# Altium schematic sheet 02_IO_Interface.SchDoc: Mainboard IO
size A3; SheetNumber: 6; SheetTotal: 13
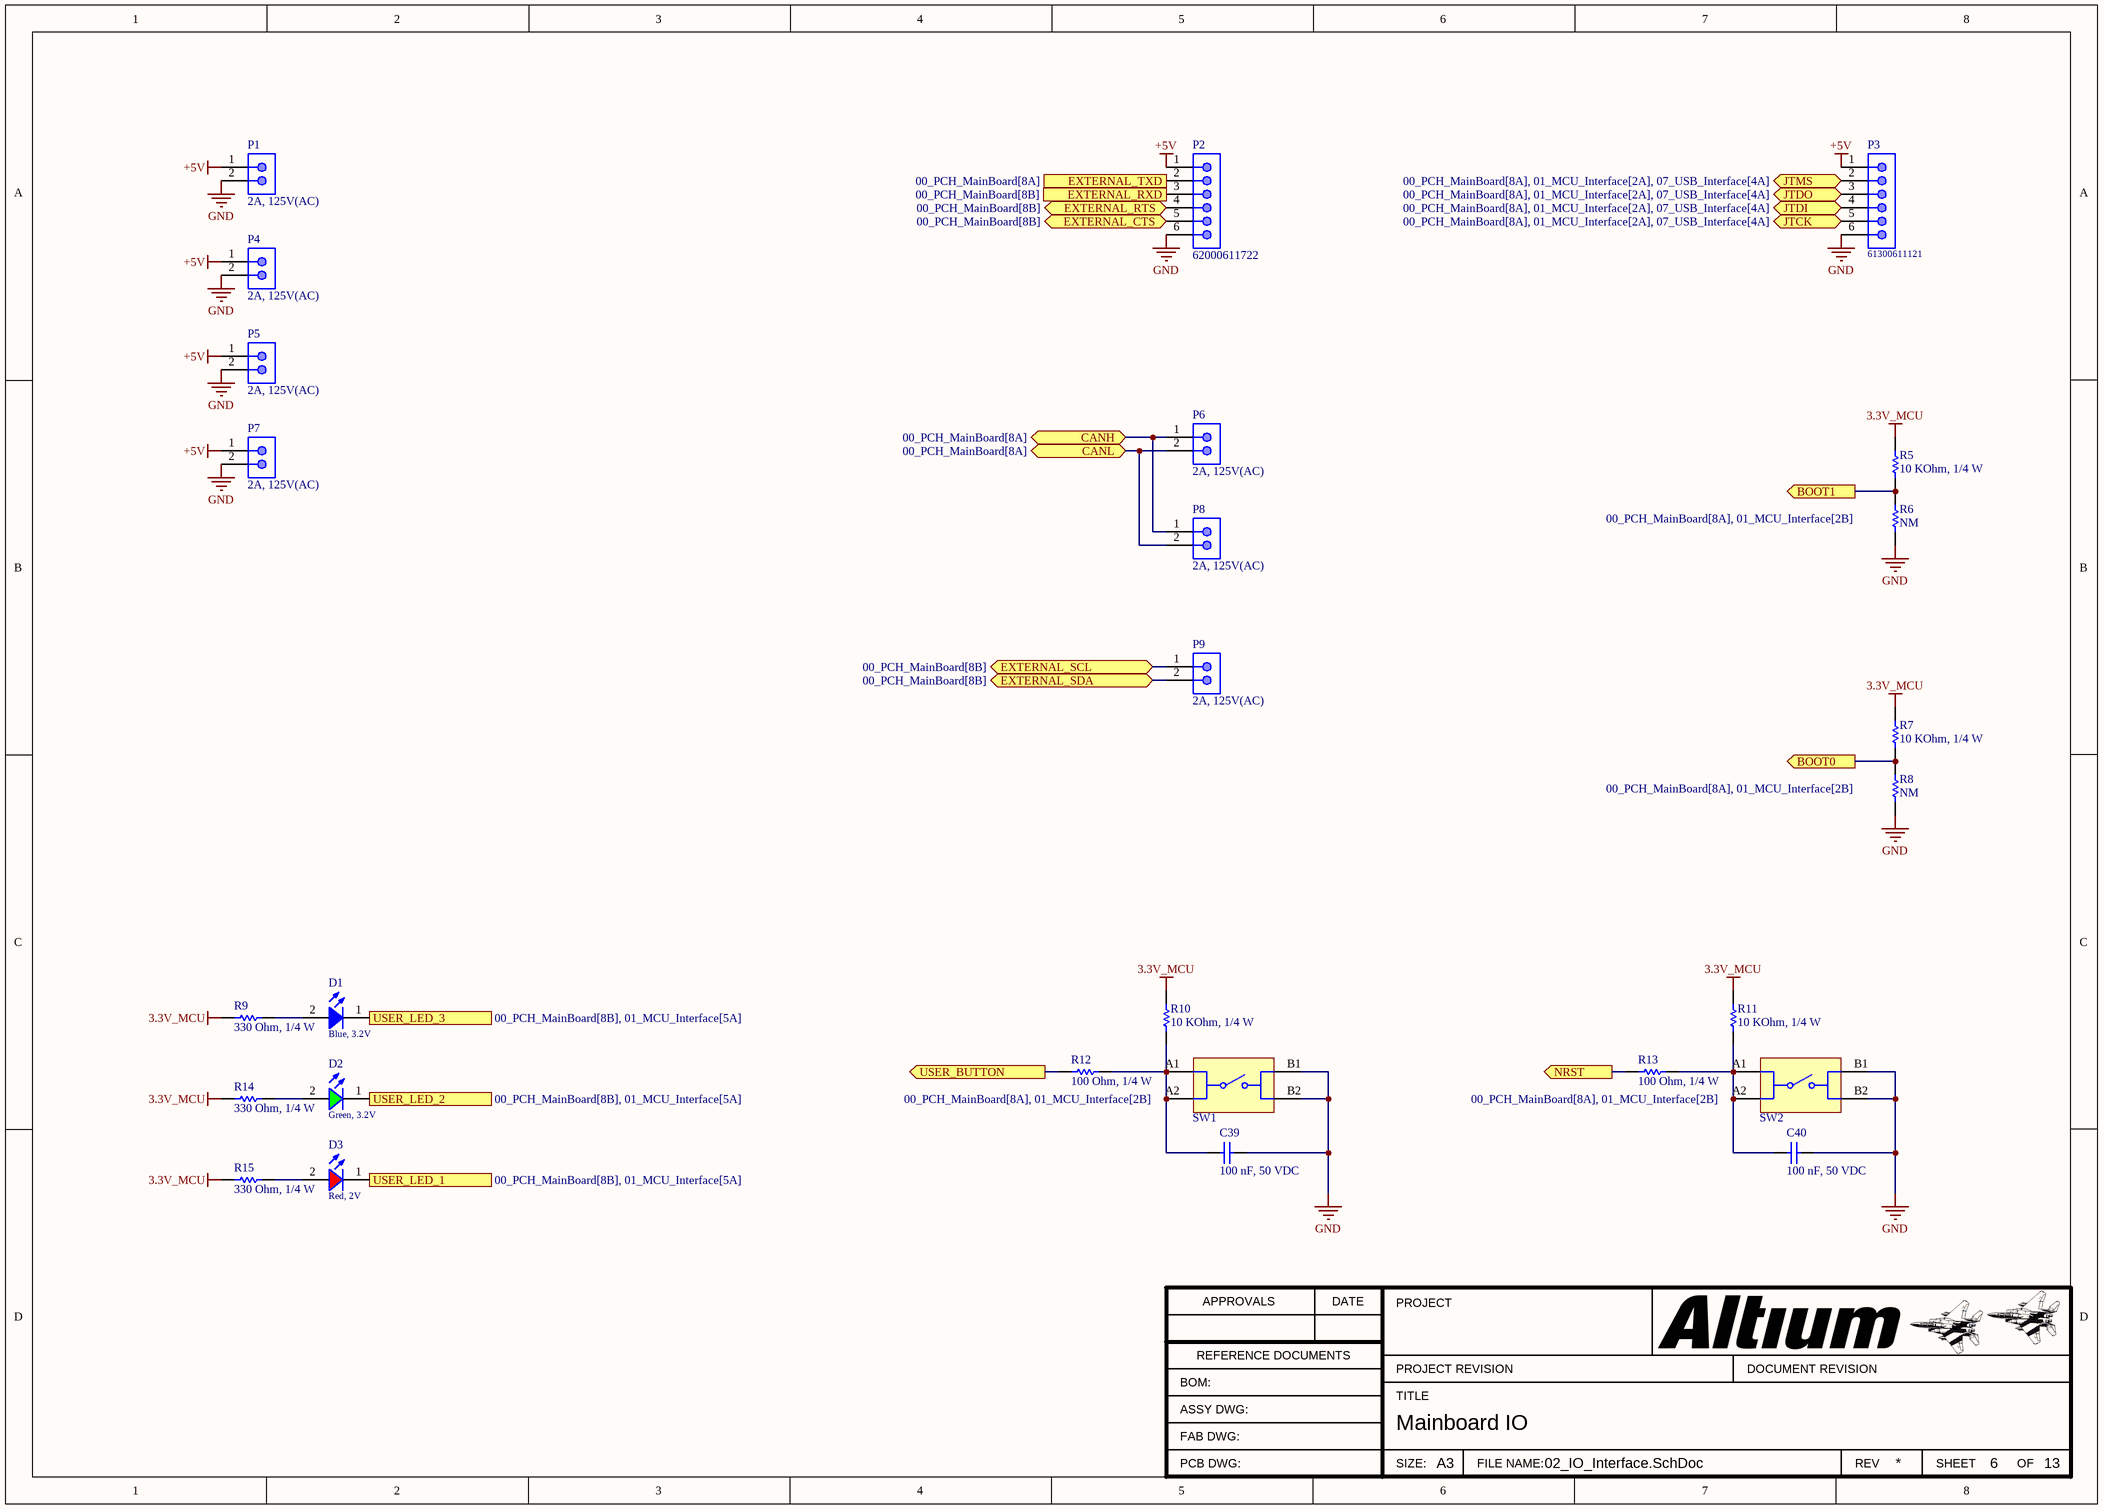
[diagram p0: 02_IO_Interface.SchDoc]

## Parts
C39  100 nF, 50 VDC  [CAP_0603]
C40  100 nF, 50 VDC  [CAP_0603]
D1  Blue, 3.2V  [WL-SMCW_0603_H=0.7mm]
D2  Green, 3.2V  [WL-SMCW_0603_H=0.7mm]
D3  Red, 2V  [WL-SMCW_0603_H=0.7mm]
P1  2A, 125V(AC)  [620102131822]
P2  62000611722  [62000611722]
P3  61300611121  [61300611121]
P4  2A, 125V(AC)  [620102131822]
P5  2A, 125V(AC)  [620102131822]
P6  2A, 125V(AC)  [620102131822]
P7  2A, 125V(AC)  [620102131822]
P8  2A, 125V(AC)  [620102131822]
P9  2A, 125V(AC)  [620102131822]
R5  10 KOhm, 1/4 W  [resistor_0603]
R6  NM  [resistor_0603]
R7  10 KOhm, 1/4 W  [resistor_0603]
R8  NM  [resistor_0603]
R9  330 Ohm, 1/4 W  [resistor_0603]
R10  10 KOhm, 1/4 W  [resistor_0603]
R11  10 KOhm, 1/4 W  [resistor_0603]
R12  100 Ohm, 1/4 W  [resistor_0603]
R13  100 Ohm, 1/4 W  [resistor_0603]
R14  330 Ohm, 1/4 W  [resistor_0603]
R15  330 Ohm, 1/4 W  [resistor_0603]
SW1  430451035836  [WS-TASV_L6W6H3.5_4304x10358x6]  (value not drawn)
SW2  430451035836  [WS-TASV_L6W6H3.5_4304x10358x6]  (value not drawn)

## Ports
BOOT0 (out, see 00_PCH_MainBoard[8A], 01_MCU_Interface[2B]), BOOT1 (out, see 00_PCH_MainBoard[8A], 01_MCU_Interface[2B]), CANH (bidir, see 00_PCH_MainBoard[8A]), CANL (bidir, see 00_PCH_MainBoard[8A]), EXTERNAL_CTS (bidir, see 00_PCH_MainBoard[8B]), EXTERNAL_RTS (bidir, see 00_PCH_MainBoard[8B]), EXTERNAL_RXD (out, see 00_PCH_MainBoard[8B]), EXTERNAL_SCL (bidir, see 00_PCH_MainBoard[8B]), EXTERNAL_SDA (bidir, see 00_PCH_MainBoard[8B]), EXTERNAL_TXD (in, see 00_PCH_MainBoard[8A]), JTCK (bidir, see 00_PCH_MainBoard[8A], 01_MCU_Interface[2A], 07_USB_Interface[4A]), JTDI (bidir, see 00_PCH_MainBoard[8A], 01_MCU_Interface[2A], 07_USB_Interface[4A]), JTDO (bidir, see 00_PCH_MainBoard[8A], 01_MCU_Interface[2A], 07_USB_Interface[4A]), JTMS (bidir, see 00_PCH_MainBoard[8A], 01_MCU_Interface[2A], 07_USB_Interface[4A]), NRST (out, see 00_PCH_MainBoard[8A], 01_MCU_Interface[2B]), USER_BUTTON (out, see 00_PCH_MainBoard[8A], 01_MCU_Interface[2B]), USER_LED_1 (out, see 00_PCH_MainBoard[8B], 01_MCU_Interface[5A]), USER_LED_2 (out, see 00_PCH_MainBoard[8B], 01_MCU_Interface[5A]), USER_LED_3 (out, see 00_PCH_MainBoard[8B], 01_MCU_Interface[5A])

## Nets
3.3V_MCU: R5.2 R7.2 R9.2 R10.2 R11.2 R14.2 R15.2
+5V: P1.1 P2.1 P3.1 P4.1 P5.1 P7.1
GND: C39.2 C40.2 P1.2 P2.6 P3.6 P4.2 P5.2 P7.2 R6.1 R8.1 SW1.B1 SW1.B2 SW2.B1 SW2.B2
BOOT0: R7.1 R8.2 ; port BOOT0
BOOT1: R5.1 R6.2 ; port BOOT1
CANH: P6.1 P8.1 ; port CANH
CANL: P6.2 P8.2 ; port CANL
EXTERNAL_CTS: P2.5 ; port EXTERNAL_CTS
EXTERNAL_RTS: P2.4 ; port EXTERNAL_RTS
EXTERNAL_RXD: P2.3 ; port EXTERNAL_RXD
EXTERNAL_SCL: P9.1 ; port EXTERNAL_SCL
EXTERNAL_SDA: P9.2 ; port EXTERNAL_SDA
EXTERNAL_TXD: P2.2 ; port EXTERNAL_TXD
JTCK: P3.5 ; port JTCK
JTDI: P3.4 ; port JTDI
JTDO: P3.3 ; port JTDO
JTMS: P3.2 ; port JTMS
NRST: R13.1 ; port NRST
USER_BUTTON: R12.1 ; port USER_BUTTON
USER_LED_1: D3.1(K) ; port USER_LED_1
USER_LED_2: D2.1(K) ; port USER_LED_2
USER_LED_3: D1.1(K) ; port USER_LED_3
NetC39_1: C39.1 R10.1 R12.2 SW1.A1 SW1.A2
NetC40_1: C40.1 R11.1 R13.2 SW2.A1 SW2.A2
NetD1_2: D1.2(A) R9.1
NetD2_2: D2.2(A) R14.1
NetD3_2: D3.2(A) R15.1

## Notes on the sheet
- APPROVALS
- DATE
- PROJECT
- BOM:
- REFERENCE DOCUMENTS
- TITLE
- PROJECT REVISION
- DOCUMENT REVISION
- ASSY DWG:
- FAB DWG:
- PCB DWG:
- SIZE:
- A3
- FILE NAME:
- REV
- SHEET
- OF

## Library data of the parts
C39 C40 = 0106031041050: CAP, size 0603, 100 nF, 50 VDC; Manufacture Name: TDK; Manufacture SN: CGA3E3X8R1H104K080AE; Capacitance: 100 nF; Tolerance: +/-10%; Voltage Rating DC: 50 VDC; ComponentLink2Description: Datasheet; ComponentLink2URL: https://product.tdk.com/system/files/dam/doc/product/capacitor/ceramic/mlcc/catalog/mlcc_automotive_soft_en.pdf?ref_disty=mouser; Operating Temperature: -55 to +125degC; Packaging: Tape and Reel; Mounting Technology: SMT; Size: 0603; Supplier 1 Name: Mouser; Supplier 1 SN: 810-CGA3E3X8R1H104KA; Supplier 1 URL: https://www.mouser.com/ProductDetail/TDK/CGA3E3X8R1H104K080AE?qs=nQSIdc08i%252Bd8g3IRRgU2bw%3D%3D&utm_source=mouser-refine-download&utm_medium=file&utm_campaign=CGA3E3X8R1H104K080AE&utm_content=TDK; Supplier 2 Name: Digi-Key; Supplier 2 SN: 445-173697-2-ND; Supplier 2 URL: https://www.digikey.com/en/products/detail/tdk-corporation/cga3e3x8r1h104k080ae/5809262; Supplier 3 Name: thegioiic; Supplier 3 SN: N/A; Supplier 3 URL: N/A; Value: 100 nF, 50 VDC
D1 = 160603BlueBlur: WL-SMCW SMT Mono-color Chip LED Blur, size 0603, Blue, 3.2V, 140deg; Color: Blue; Size: 0603; Type: Blur; ComponentLink1Description: Datasheet link; ComponentLink1URL: N/A; ComponentLink2Description: Supplier 1 URL; ComponentLink2URL: https://www.mouser.vn/ProductDetail/ams-OSRAM/LB-Q39E-L2OO-35-1?qs=74fRo9GAWsz%2FeNvglIOl1w%3D%3D; ComponentLink3Description: Supplier 2 URL; ComponentLink3URL: https://www.digikey.com/en/products/detail/ams-osram-usa-inc/LB-Q39E-N1OO-35-1/2176321; ComponentLink4Description: Supplier 3 URL; ComponentLink4URL: N/A; Supplier 1 Name: Mouser; Supplier 1 SN: 720-LBQ39EL2N2351; Supplier 1 URL: https://www.mouser.vn/ProductDetail/ams-OSRAM/LB-Q39E-L2OO-35-1?qs=74fRo9GAWsz%2FeNvglIOl1w%3D%3D; Supplier 2 Name: Digi-Key; Supplier 2 SN: 475-LBQ39E-N1OO-35-1TR-ND; Supplier 2 URL: https://www.digikey.com/en/products/detail/ams-osram-usa-inc/LB-Q39E-N1OO-35-1/2176321; Supplier 3 Name: ICDayRoi; Supplier 3 SN: N/A; Supplier 3 URL: N/A; Value: Blue, 3.2V
D2 = 160603GreenBlur: WL-SMCW SMT Mono-color Chip LED Blur, size 0603, Green, 3.2V, 140deg; Color: Green; Size: 0603; Type: Blur; ComponentLink1Description: Datasheet link; ComponentLink1URL: N/A; ComponentLink2Description: Supplier 1 URL; ComponentLink2URL: https://www.mouser.vn/ProductDetail/ROHM-Semiconductor/SMLD12EN1WT86?qs=qSfuJ%252Bfl%2Fd4fR%252B9yZydIwg%3D%3D; ComponentLink3Description: Supplier 2 URL; ComponentLink3URL: https://www.digikey.com/en/products/detail/rohm-semiconductor/SML-D12M8WT86/1641797; ComponentLink4Description: Supplier 3 URL; ComponentLink4URL: N/A; Supplier 1 Name: Mouser; Supplier 1 SN: 755-SMLD12EN1WT86; Supplier 1 URL: https://www.mouser.vn/ProductDetail/ROHM-Semiconductor/SMLD12EN1WT86?qs=qSfuJ%252Bfl%2Fd4fR%252B9yZydIwg%3D%3D; Supplier 2 Name: Digi-Key; Supplier 2 SN: 511-1578-2-ND; Supplier 2 URL: https://www.digikey.com/en/products/detail/rohm-semiconductor/SML-D12M8WT86/1641797; Supplier 3 Name: ICDayRoi; Supplier 3 SN: N/A; Supplier 3 URL: N/A; Value: Green, 3.2V
D3 = 160603RedBlur: WL-SMCW SMT Mono-color Chip LED Blur, size 0603, Red, 2V, 140deg; Color: Red; Size: 0603; Type: Blur; ComponentLink1Description: Datasheet link; ComponentLink1URL: N/A; ComponentLink2Description: Supplier 1 URL; ComponentLink2URL: https://www.mouser.vn/ProductDetail/ROHM-Semiconductor/CSL1901VW1?qs=vvQtp7zwQdNmrXZcE27xEA%3D%3D; ComponentLink3Description: Supplier 2 URL; ComponentLink3URL: https://www.digikey.com/en/products/detail/rohm-semiconductor/SML-D12U8WT86/1641799; ComponentLink4Description: Supplier 3 URL; ComponentLink4URL: N/A; Supplier 1 Name: Mouser; Supplier 1 SN: 755-CSL1901VW1; Supplier 1 URL: https://www.mouser.vn/ProductDetail/ROHM-Semiconductor/CSL1901VW1?qs=vvQtp7zwQdNmrXZcE27xEA%3D%3D; Supplier 2 Name: Digi-Key; Supplier 2 SN: 511-1580-2-ND; Supplier 2 URL: https://www.digikey.com/en/products/detail/rohm-semiconductor/SML-D12U8WT86/1641799; Supplier 3 Name: ICDayRoi; Supplier 3 SN: N/A; Supplier 3 URL: N/A; Value: Red, 2V
P1 P4-P9 = 620102131822: WR-WTB SMT Male Horizontal Shrouded Header, pitch 2mm, 2p; Pin Number: 2; Contact Resistance: 20mOhm; Withstanding Voltage: 800VAC; Working Voltage: 100VAC; ComponentLink1Description: Datasheet link; ComponentLink1URL: https://www.we-online.com/catalog/datasheet/620102131822.pdf; ComponentLink2Description: Supplier 1 URL; ComponentLink2URL: https://www.mouser.vn/ProductDetail/Wurth-Elektronik/620102131822?qs=ZtY9WdtwX54K2dkLvxjzuQ%3D%3D; Pitch: 2mm; Published Date: January 2020; Publisher: Wurth Elektronik; Mounting Technology: SMT; Packaging: Tape and Reel; Operating Temperature: -25 to +85degC; Part Number: 620102131822; Gender: Male; Type: Horizontal; Rated Current: 2A; ComponentLink3Description: Supplier 2 URL; ComponentLink3URL: N/A; ComponentLink4Description: Supplier 3 URL; ComponentLink4URL: https://www.thegioiic.com/dau-ph-2-0mm-2-chan-dan-smd-nam-ngang; Supplier 1 Name: Mouser; Supplier 1 SN: 710-620102131822; Supplier 1 URL: https://www.mouser.vn/ProductDetail/Wurth-Elektronik/620102131822?qs=ZtY9WdtwX54K2dkLvxjzuQ%3D%3D; Supplier 2 Name: Digi-Key; Supplier 2 SN: N/A; Supplier 2 URL: N/A; Supplier 3 Name: thegioiic; Supplier 3 SN: N/A; Supplier 3 URL: https://www.thegioiic.com/dau-ph-2-0mm-2-chan-dan-smd-nam-ngang; Value: 2A, 125V(AC)
P2 = 62000611722: WR-WTB THT Male Horizontal Shrouded Header, pitch 2mm, 6p; Pin Number: 6; Contact Resistance: 20mOhm; Rated Current: 2A; Withstanding Voltage: 800VAC; Working Voltage: 125VAC; Value: 2A, 125V(AC); ComponentLink1Description: Datasheet link; ComponentLink1URL: https://www.we-online.com/catalog/datasheet/62000611722.pdf; ComponentLink2Description: Supplier 1 URL; ComponentLink2URL: N/A; Pitch: 2mm; Published Date: January 2020; Publisher: Wurth Elektronik; Mounting Technology: THT; Packaging: Bag; Operating Temperature: -25 to +85degC; Part Number: 62000611722; Gender: Male; Type: Horizontal; ComponentLink3Description: Supplier 2 URL; ComponentLink3URL: N/A; Supplier 1 Name: Mouser; Supplier 1 SN: N/A; Supplier 1 URL: N/A; Supplier 2 Name: Digi-Key; Supplier 2 SN: N/A; Supplier 2 URL: N/A; Supplier 3 Name: thegioiic; Supplier 3 SN: N/A; Supplier 3 URL: https://www.thegioiic.com/dau-ph-2-0mm-6-chan-cong-xuyen-lo; ComponentLink4Description: Supplier 3 URL; ComponentLink4URL: https://www.thegioiic.com/dau-ph-2-0mm-6-chan-cong-xuyen-lo
P3 = 61300611121: WR-PHD Pin Header, THT, pitch 2.54mm, Single Row, Vertical, 6p; Manufacturer: Wurth Elektronik; Pin Number: 6; Rated Current: 3A; Working Voltage: 250VAC; Withstanding Voltage: 500VAC; Contact Resistance: 20mOhm; Supply Name 1: Mouser; ComponentLink1Description: Manufacturer; ComponentLink1URL: http://www.we-online.de; ComponentLink2Description: Datasheet; ComponentLink2URL: https://www.we-online.com/catalog/datasheet/61300611121.pdf; Manufacturer Part Number: 61300611121; Published Date: May 2020; Pitch: 2.54mm; Operating Temperature: -40 to +105degC; Mounting Technology: THT; Packaging: Bag; Gender: Pin Header; Row Number: Single; Orientation: Vertical; ComponentLink3Description: Global Supply; ComponentLink3URL: https://www.we-online.com/en/components/products/PHD_2_54_THT_PIN_HEADER_6130XX11121?sq=61300611121#61300611121; ComponentLink4Description: Global Supply; ComponentLink4URL: https://www.mouser.vn/ProductDetail/Wurth-Elektronik/61300611121?qs=t4813l51qx%2FRpdf0Kp1HlQ%3D%3D; Supplier 1 Name: Mouser; Supplier 1 SN: 710-61300611121; Supplier 1 URL: https://www.mouser.vn/ProductDetail/Wurth-Elektronik/61300611121?qs=t4813l51qx%2FRpdf0Kp1HlQ%3D%3D; Supplier 2 Name: Digi-Key; Supplier 2 SN: N/A; Supplier 2 URL: N/A; Supplier 3 Name: thegioiic; Supplier 3 SN: N/A; Supplier 3 URL: N/A
R5 R7 R10 R11 = 0006031031: RES, size 0603, 10 KOhm, 1/4 W; Manufacture  Name: OEM; Resistance: 10 KOhm; Rated Power: 1/4 W; Resistance Tolerance: +/-1%; Size: 0603; Mounting Technology: SMT; Supplier 1 Name: Mouser; Supplier 1 SN: 755-ESR03EZPF1002; Supplier 2 Name: Digi-Key; Supplier 2 SN: RHM10KADTR-ND RHM10KADCT-ND RHM10KADDKR-ND; Supplier 1 URL: https://www.mouser.vn/ProductDetail/ROHM-Semiconductor/ESR03EZPF1002?qs=sGAEpiMZZMvdGkrng054t67Efho1F8r6CDeAsqwFse8%3D; Supplier 3 Name: thegioiic; Supplier 3 SN: N/A; Supplier 3 URL: N/A; Manufacture  SN: OEM; Value: 10 KOhm, 1/4 W; ComponentLink1Description: Datasheet link; ComponentLink1URL: https://fscdn.rohm.com/en/products/databook/datasheet/passive/resistor/chip_resistor/esr-e.pdf; ComponentLink2Description: Supplier 1 URL; ComponentLink2URL: N/A; ComponentLink3Description: Supplier 2 URL; ComponentLink3URL: https://www.digikey.com/en/products/detail/rohm-semiconductor/ESR03EZPF1002/1983429; ComponentLink4Description: Supplier 3 URL; ComponentLink4URL: N/A; Supplier 2 URL: https://www.digikey.com/en/products/detail/rohm-semiconductor/ESR03EZPF1002/1983429
R6 R8 = 000603_NM: RES, size 0603, NM; Resistance: NM; Size: 0603; Rated Power: N/A; Mounting Technology: SMT; Supplier 1 Name: Mouser; Supplier 1 SN: N/A; Supplier 2 Name: Digi-Key; Supplier 2 SN: N/A; Supplier 1 URL: N/A; Supplier 3 Name: thegioiic; Supplier 3 SN: N/A; Supplier 3 URL: N/A; Manufacture  Name: N/A; Manufacture  SN: N/A; Value: NM; ComponentLink1Description: Datasheet link; ComponentLink1URL: N/A; ComponentLink2Description: Supplier 1 URL; ComponentLink2URL: N/A; ComponentLink3Description: Supplier 2 URL; ComponentLink3URL: N/A; ComponentLink4Description: Supplier 3 URL; ComponentLink4URL: N/A; Resistance Tolerance: N/A; Supplier 2 URL: N/A
R9 R14 R15 = 0006033311: RES, size 0603, 330 Ohm, 1/4 W; Manufacture  Name: OEM; Resistance: 330 Ohm; Rated Power: 1/4 W; Resistance Tolerance: +/-1%; Size: 0603; Mounting Technology: SMT; Supplier 1 Name: Mouser; Supplier 1 SN: 667-ERJ-UP3F3300V; Supplier 2 Name: Digi-Key; Supplier 2 SN: 10-ERJ-UP3F3300VTR-ND 10-ERJ-UP3F3300VCT-ND 10-ERJ-UP3F3300VDKR-ND; Supplier 1 URL: https://www.mouser.vn/ProductDetail/Panasonic/ERJ-UP3F3300V?qs=sGAEpiMZZMvdGkrng054twq3eZrCFN89MDZusw5Tf7mZnfRSpxxqIA%3D%3D; Supplier 3 Name: thegioiic; Supplier 3 SN: N/A; Supplier 3 URL: N/A; Manufacture  SN: OEM; Value: 330 Ohm, 1/4 W; ComponentLink1Description: Datasheet link; ComponentLink1URL: https://api.pim.na.industrial.panasonic.com/file_stream/main/fileversion/4484; ComponentLink2Description: Supplier 1 URL; ComponentLink2URL: N/A; ComponentLink3Description: Supplier 2 URL; ComponentLink3URL: https://www.digikey.com/en/products/detail/panasonic-electronic-components/ERJ-UP3F3300V/12093106; ComponentLink4Description: Supplier 3 URL; ComponentLink4URL: N/A; Supplier 2 URL: https://www.digikey.com/en/products/detail/panasonic-electronic-components/ERJ-UP3F3300V/12093106
R12 R13 = 0006031011: RES, size 0603, 100 Ohm, 1/4 W; Manufacture  Name: OEM; Resistance: 100 Ohm; Rated Power: 1/4 W; Resistance Tolerance: +/-1%; Size: 0603; Mounting Technology: SMT; Supplier 1 Name: Mouser; Supplier 1 SN: 603-SR0603FR-7T100RL; Supplier 2 Name: Digi-Key; Supplier 2 SN: YAG5822TR-ND YAG5822CT-ND YAG5822DKR-ND; Supplier 1 URL: https://www.mouser.vn/ProductDetail/YAGEO/SR0603FR-7T100RL?qs=sGAEpiMZZMvdGkrng054tz1y1XEHv7sNOEBvi%2FAEoxbcgRjDGFawVw%3D%3D; Supplier 3 Name: thegioiic; Supplier 3 SN: N/A; Supplier 3 URL: N/A; Manufacture  SN: OEM; Value: 100 Ohm, 1/4 W; ComponentLink1Description: Datasheet link; ComponentLink1URL: https://www.yageo.com/upload/media/product/productsearch/datasheet/rchip/PYu-SR_20105_RoHS_L_10.pdf; ComponentLink2Description: Supplier 1 URL; ComponentLink2URL: N/A; ComponentLink3Description: Supplier 2 URL; ComponentLink3URL: https://www.digikey.com/en/products/detail/yageo/SR0603FR-7T100RL/9373096https://www.digikey.com/en/products/detail/yageo/SR0603FR-7T100RL/9373096; ComponentLink4Description: Supplier 3 URL; ComponentLink4URL: N/A; Supplier 2 URL: https://www.digikey.com/en/products/detail/yageo/SR0603FR-7T100RL/9373096https://www.digikey.com/en/products/detail/yageo/SR0603FR-7T100RL/9373096
SW1 SW2 = 430451035836: WS-TASV SMT Washable Tact Switch, L6 x W6 x H3.5mm, 360g, SPST-NO, 12V, 50mA; Manufacturer: Wurth Elektronik; Washable: Yes; Rated Voltage: 12VDC; Manufacturer Part Number: 430451035836; Category: Tact Switches; Match Code: WS-TASV; ComponentLink2Description: Datasheet Link; ComponentLink2URL: https://www.we-online.com/redexpert/spec/430451035836?ad; Mount: Surface Mount; Operating Temperature Max: 85°C; Operating Temperature Min: -40°C; Packaging: Tape and Reel; Length: 6mm; Width: 6mm; Height: 3.5mm; Circuit: SPST-NO; Contact Material: Stainless Steel; Operation Force: 360g; Rated Current: 50mA; Terminal Material: Brass; Terminal Plating: Silver; Supplier 3 Name: Thegioiic; Supplier 3 SN: N/A; Supplier 3 URL: https://www.thegioiic.com/nut-nhan-6x6mm-cao-3-4mm-4-chan-smd-dau-do; Supplier 1 Name: Mouser; Supplier 1 SN: 710-430451035836; Supplier 1 URL: https://www.mouser.vn/ProductDetail/Wurth-Elektronik/430451035836?qs=wr8lucFkNMVsx4f3WHCAuQ%3D%3D; Supplier 2 Name: Digi-Key; Supplier 2 SN: 732-7012-2-ND; Supplier 2 URL: https://www.digikey.com/en/products/detail/w%C3%BCrth-elektronik/430451035836/5209030